# Altium schematic sheet Topsheet.SchDoc
size A4; SheetNumber: 1; SheetTotal: 2
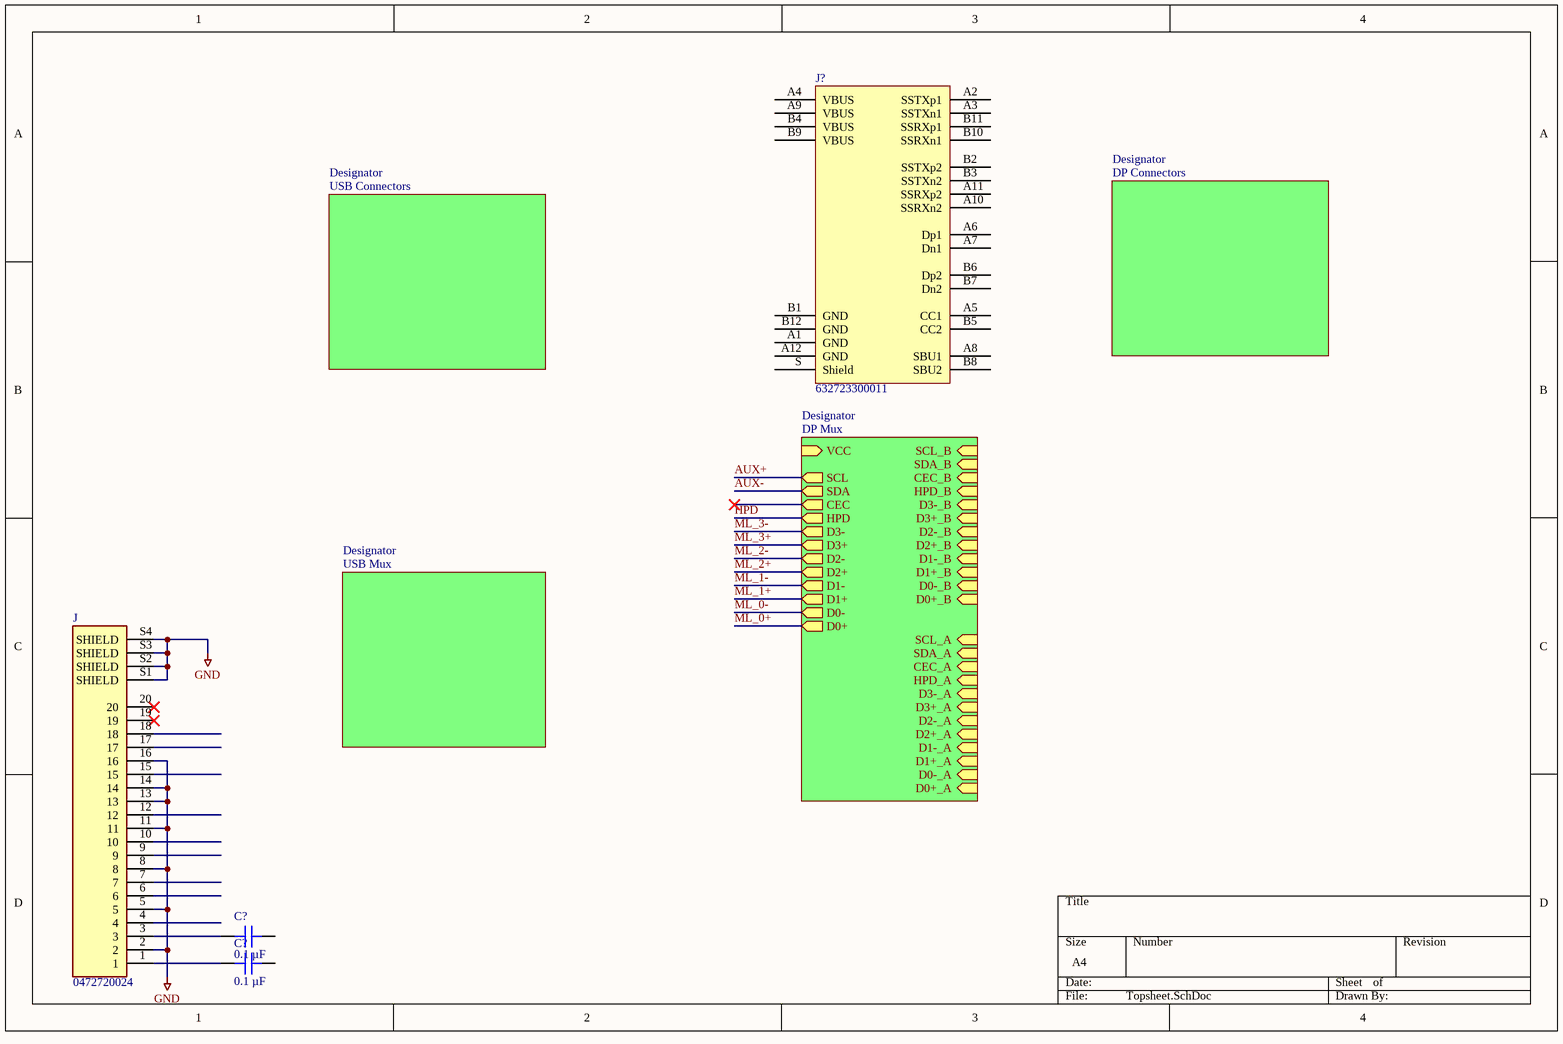
[diagram p0: Topsheet.SchDoc]

## Parts
(Parts that share a designator on the sheet are numbered #1, #2 ... from top to bottom, then left to right.)
C?#1  0.1 µF  [CAP 0402_1005]
C?#2  0.1 µF  [CAP 0402_1005]
J  0472720024  [MOLEX_0472720024]
J?  632723300011  [WURTH 632723300011]

## Sub-sheets
Designator = USB Mux: no entries
Designator = DP Mux: VCC (in), D0+ (out), D0- (out), D1+ (out), D1- (out), D2+ (out), D2- (out), D3+ (out), D3- (out), D0+_A (in), D0-_A (in), D1+_A (in), D1-_A (in), D2+_A (in), D2-_A (in), D3+_A (in), D3-_A (in), D0+_B (in), D0-_B (in), D1+_B (in), D1-_B (in), D2+_B (in), D2-_B (in), D3+_B (in), D3-_B (in), SCL_A (in), SDA_A (in), HPD_A (in), CEC_A (in), SCL_B (in), SDA_B (in), HPD_B (in), CEC_B (in), HPD (out), CEC (out), SDA (out), SCL (out)
Designator = USB Connectors: no entries
Designator = DP Connectors: no entries

## Nets
GND: J.2 J.5 J.8 J.11 J.13 J.14 J.16 J.S1(SHIELD) J.S2(SHIELD) J.S3(SHIELD) J.S4(SHIELD)
AUX+: sheet Designator/SCL
AUX-: sheet Designator/SDA
HPD: sheet Designator/HPD
ML_0+: sheet Designator/D0+
ML_0-: sheet Designator/D0-
ML_1+: sheet Designator/D1+
ML_1-: sheet Designator/D1-
ML_2+: sheet Designator/D2+
ML_2-: sheet Designator/D2-
ML_3+: sheet Designator/D3+
ML_3-: sheet Designator/D3-
NetC?#1_1: C?#1.1 J.3
NetC?#2_1: C?#2.1 J.1

Not connected (* = marked no-connect by the designer): C?#1 2; C?#2 2; J 4 6 7 9 10 12 15 17 18 19* 20*; J? A1(GND) A2(SSTXp1) A3(SSTXn1) A4(VBUS) A5(CC1) A6(Dp1) A7(Dn1) A8(SBU1) A9(VBUS) A10(SSRXn2) A11(SSRXp2) A12(GND) B1(GND) B2(SSTXp2) B3(SSTXn2) B4(VBUS) B5(CC2) B6(Dp2) B7(Dn2) B8(SBU2) B9(VBUS) B10(SSRXn1) B11(SSRXp1) B12(GND) S(Shield)

## Library data of the parts
C?#1 C?#2 = C0402C104K4RECAUTO: CAP CER 0402 0.1UF 16V X7R 10%; manufacturer: KEMET; Part Number: C0402C104K4RECAUTO; Value: 0.1 µF; Applications: Automotive, ESD Protection; Capacitance: 0.1 µF; componentlink1description: Datasheet; componentlink1url: https://api.kemet.com/component-edge/download/datasheet/C0402C104K4RECAUTO.pdf; componentlink2description: DigiKey Link; componentlink2url: https://www.digikey.com/en/products/detail/kemet/C0402C104K4RECAUTO/8563695; Device Package: 0402 (1005 Metric); lastupdated: 2022-09-19 12:57:36 PM; Lifecycle Status: Active; Minimum Order: 1; Mounting Type: Surface Mount, MLCC; Operating Temperature: -55°C ~ 125°C; Package / Case: 0402 (1005 Metric); packaging: TapeAndReel; partid: 1731; Part Status: Active; price: 0.01; Ratings: AEC-Q200; series: ESD SMD Auto X7R; Size / Dimension: 0.039" L x 0.020" W (1.00mm x 0.50mm); Supplier 1: DigiKey; Supplier Part Number 1: 399-17167-1-ND; Temperature Coefficient: X7R; Thickness (Max): 0.022" (0.55mm); Tolerance: ±10%; Voltage - Rated: 16V
J = 0472720024: DisplayPort Receptacle Connector 20 Position Surface Mount, Right Angle; Through Hole; MF: Molex; Package: None; SnapEDA_Link: https://www.snapeda.com/parts/0472720024/Molex/view-part/1233594/?ref=snap; Availability: Unavailable; MP: 0472720024; Price: None; Value: *
J? = 632723300011: CONN RCP USB3.1 TYPEC 24P SMD RA; Manufacturer: Würth Elektronik; Connector Type: USB - C (Type - C); Current Rating (Amps): 5A; Gender: Receptacle; Mating Cycles: 10000; Number of Contacts: 24; Number of Ports: 1; Shielding: Unshielded; Specifications: USB 3.1 (USB 3.1 Gen 2, Superspeed+); Voltage - Rated: 20VDC; Part Number: 632723300011; ComponentLink1Description: Datasheet; ComponentLink1URL: https://katalog.we-online.de/em/datasheet/632723x00011.pdf; ComponentLink2Description: DigiKey Link; ComponentLink2URL: http://digikey.com/product-detail/en/w-rth-elektronik/632723300011/732-9618-1-ND/5806673; LastUpdated: 2020-05-24 10:36:40 PM; Lifecycle Status: Active; Minimum Order: 1; Mounting Feature: Horizontal; Mounting Type: Surface Mount, Right Angle; Through Hole; Operating Temperature: -40°C ~ 105°C; Packaging: TapeAndReel; Part Status: Active; Price: 2.95; Series: WR-COM; Supplier 1: DigiKey; Supplier Part Number 1: 732-9618-1-ND; Termination: Solder